# EAGLE schematic aux1.95 (EAGLE 6.5.0)
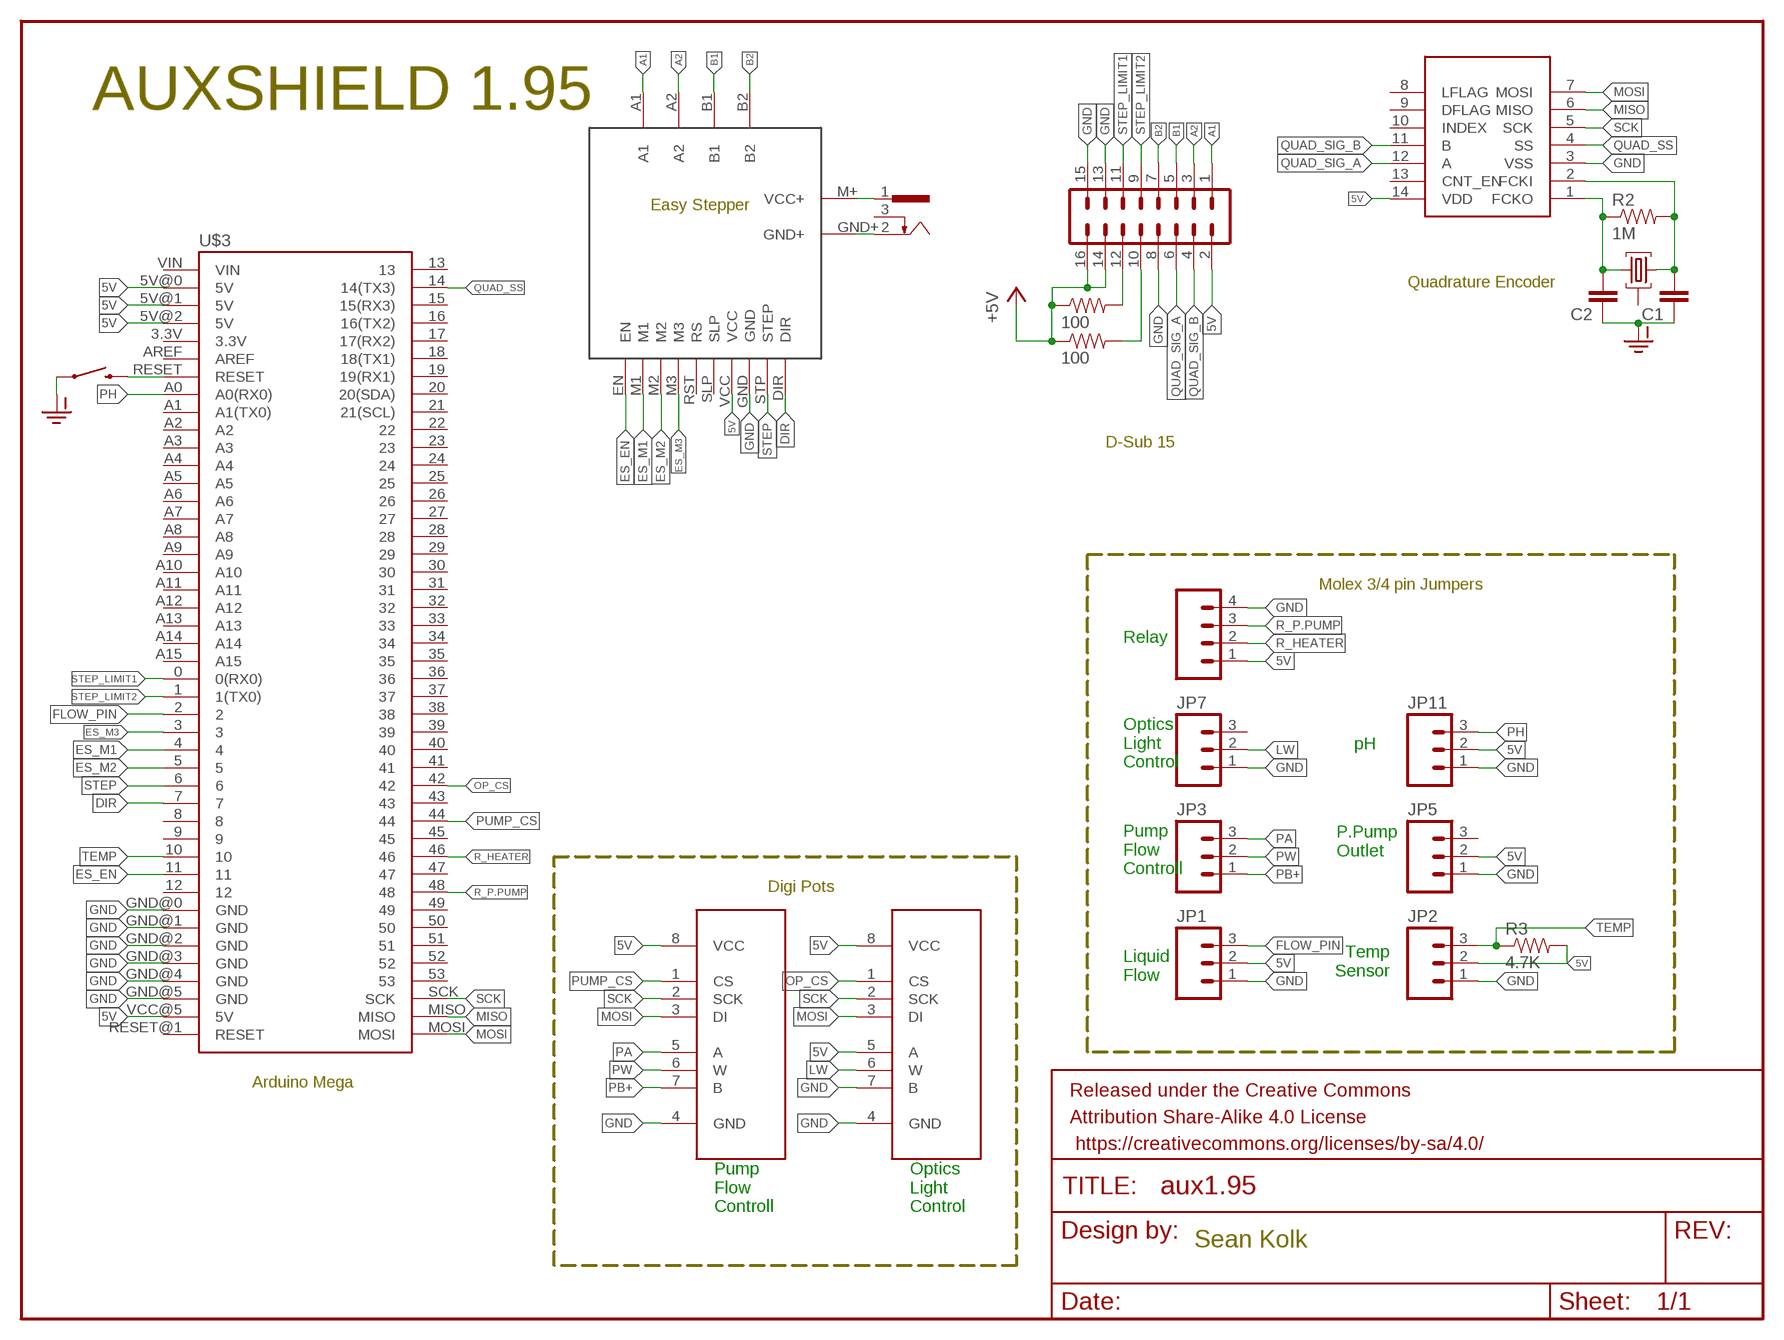
[diagram p0: schematic, sheet 1]

## Parts
C1  0.1UF-50V-20%(PTH)KIT-EZ  [CAP-PTH-SMALL-KIT]
C2  0.1UF-50V-20%(PTH)KIT-EZ  [CAP-PTH-SMALL-KIT]
FRAME1  FRAME-LETTER  [CREATIVE_COMMONS]
JP1  M03POLAR  [MOLEX-1X3]
JP2  M03POLAR  [MOLEX-1X3]
JP3  M03POLAR  [MOLEX-1X3]
JP5  M03POLAR  [MOLEX-1X3]
JP7  M03POLAR  [MOLEX-1X3]
JP11  M03POLAR  [MOLEX-1X3]
PUMPDIGIPOT  MCP41XXXDIL  [DIL-08]
QF2  14M20BHC49T  [HC49U]
R1  100  10OHM-1/4W-5%(PTH)  [AXIAL-0.3]
R2  1M  10OHM-1/4W-5%(PTH)  [AXIAL-0.3]
R3  4.7K  10OHM-1/4W-5%(PTH)  [AXIAL-0.3]
R4  100  10OHM-1/4W-5%(PTH)  [AXIAL-0.3]
RELAY  M04POLAR  [MOLEX-1X4]
S1  SWITCH-MOMENTARY-2PTH_EZ  [TACTILE-PTH-EZ]
U1  MCP41XXXDIL  [DIL-08]
U$1  M08X2  [2X8]
U$2  LS7366R  [SO014]
U$3  ARDUINO-MEGA-V2  [ARDUINO_MEGA-PRO-5V]
U$4  BIG_EASY_DRIVER  [BIG_EASY_DRIVER_PACK]
X1  SCD-014A  [SCD-014-A]

## Nets
5V: JP1.2 JP2.2 JP5.2 JP11.2 PUMPDIGIPOT.8(VCC) R1.P$1 R3.P$2 R4.P$1 RELAY.1 U1.5(A) U1.8(VCC) U$1.2 U$1.14 U$1.16 U$2.14(VDD) U$3.5V@0(5V) U$3.5V@1(5V) U$3.5V@2(5V) U$3.VCC@5(5V) U$4.VCC ; supply symbol labelled +5V
A1: U$1.1 U$4.A1
A2: U$1.3 U$4.A2
B1: U$1.5 U$4.B1
B2: U$1.7 U$4.B2
DIR: U$3.7 U$4.DIR
ES_EN: U$3.11 U$4.EN
ES_M1: U$3.4 U$4.M1
ES_M2: U$3.5 U$4.M2
ES_M3: U$3.3 U$4.M3
FLOW_PIN: JP1.3 U$3.2
GND: C1.1 C2.1 JP1.1 JP2.1 JP5.1 JP7.1 JP11.1 PUMPDIGIPOT.4(GND) RELAY.4 S1.1 U1.4(GND) U1.7(B) U$1.8 U$1.13 U$1.15 U$2.3(VSS) U$3.GND@0(GND) U$3.GND@1(GND) U$3.GND@2(GND) U$3.GND@3(GND) U$3.GND@4(GND) U$3.GND@5(GND) U$4.GND ; supply symbol labelled GND-ISO
LW: JP7.2 U1.6(W)
MISO: U$2.6(MISO) U$3.MISO
MOSI: PUMPDIGIPOT.3(DI) U1.3(DI) U$2.7(MOSI) U$3.MOSI
N$1: U$4.M+(VCC+) X1.1
N$2: U$4.GND+ X1.2
N$4: R1.P$2 U$1.10
N$9: S1.3 U$3.RESET
N$12: C1.2 QF2.3 R2.P$2 U$2.2(FCKI)
N$25: C2.2 QF2.1 R2.P$1 U$2.1(FCKO)
N$33: R4.P$2 U$1.12
OP_CS: U1.1(CS) U$3.42
PA: JP3.3 PUMPDIGIPOT.5(A)
PB+: JP3.1 PUMPDIGIPOT.7(B)
PH: JP11.3 U$3.A0(A0(RX0))
PUMP_CS: PUMPDIGIPOT.1(CS) U$3.44
PW: JP3.2 PUMPDIGIPOT.6(W)
QUAD_SIG_A: U$1.6 U$2.12(A)
QUAD_SIG_B: U$1.4 U$2.11(B)
QUAD_SS: U$2.4(SS) U$3.14(14(TX3))
R_HEATER: RELAY.2 U$3.46
R_P.PUMP: RELAY.3 U$3.48
SCK: PUMPDIGIPOT.2(SCK) U1.2(SCK) U$2.5(SCK) U$3.SCK
STEP: U$3.6 U$4.STP(STEP)
STEP_LIMIT1: U$1.11 U$3.0(0(RX0))
STEP_LIMIT2: U$1.9 U$3.1(1(TX0))
TEMP: JP2.3 R3.P$1 U$3.10
Unconnected: JP5.3 JP7.3 QF2.2 U$2.8(LFLAG) U$2.9(DFLAG) U$2.10(INDEX) U$2.13(CNT_EN) U$3.3.3V U$3.8 U$3.9 U$3.12 U$3.13 U$3.15(15(RX3)) U$3.16(16(TX2)) U$3.17(17(RX2)) U$3.18(18(TX1)) U$3.19(19(RX1)) U$3.20(20(SDA)) U$3.21(21(SCL)) U$3.22 U$3.23 U$3.24 U$3.25 U$3.26 U$3.27 U$3.28 U$3.29 U$3.30 U$3.31 U$3.32 U$3.33 U$3.34 U$3.35 U$3.36 U$3.37 U$3.38 U$3.39 U$3.40 U$3.41 U$3.43 U$3.45 U$3.47 U$3.49 U$3.50 U$3.51 U$3.52 U$3.53 U$3.A1(A1(TX0)) U$3.A2 U$3.A3 U$3.A4 U$3.A5 U$3.A6 U$3.A7 U$3.A8 U$3.A9 U$3.A10 U$3.A11 U$3.A12 U$3.A13 U$3.A14 U$3.A15 U$3.AREF U$3.RESET@1(RESET) U$3.VIN U$4.RST(RS) U$4.SLP X1.3

## Notes on the sheet
- AUXSHIELD 1.95
- Easy Stepper
- Quadrature Encoder
- D-Sub 15
- Molex 3/4 pin Jumpers
- Relay
- pH
- Optics
  Light 
  Control
- P.Pump 
  Outlet
- Pump
  Flow
  Controll
- Digi Pots
- Temp
  Sensor
- Liquid 
  Flow
- Arduino Mega
- Pump
  Flow
  Controll
- Optics
  Light
  Control
- Sean Kolk

## Library data of the parts
C1 C2 = SparkFun-Capacitors:0.1UF-50V-20%(PTH): CAP-08370; PROD_ID: CAP-08370
FRAME1 = SparkFun-Aesthetics:FRAME-LETTER: Schematic Frame Standard 8.5x11 US Letter frame
JP1-JP3 JP5 JP7 JP11 = SparkFun-Connectors:M03: Header 3 Standard 3-pin 0.1" header. Use with straight break away headers (SKU : PRT-00116), right angle break away headers (PRT-00553), swiss pins (PRT-00743), machine pins (PRT-00117), and female headers (PRT-00115). Molex polarized connector foot print use with SKU : PRT-08232 with associated crimp pins and housings.
PUMPDIGIPOT U1 = SparkFun-AnalogIC:MCP41XXX: SPI controlled single digital potentiometer by Microchip PID: COM-10613
QF2 = crystal:14M20BHC49T: Monolithic Crystal Filters Source: www.vanlong.com; OC_FARNELL: unknown; OC_NEWARK: unknown
R1-R4 = SparkFun-Resistors:10OHM-1/4W-5%(PTH): RES-10698; PROD_ID: RES-10698; VALUE: 10
RELAY = SparkFun-Connectors:M04: Header 4 Standard 4-pin 0.1" header. Use with straight break away headers (SKU : PRT-00116), right angle break away headers (PRT-00553), swiss pins (PRT-00743), machine pins (PRT-00117), and female headers (PRT-00115). Molex polarized connector foot print use with SKU : PRT-08231 with associated crimp pins and housings. 1MM SMD Version SKU: PRT-10208
S1 = SparkFun-Electromechanical:SWITCH-MOMENTARY-2: Various NO switches- pushbuttons, reed, etc
U$1 = SparkFun-Connectors:M08X2: .1" headers, two rows of 8 each
U$2 = SparkFun-DigitalIC:LS7366R
U$3 = MEGASHIELD2:ARDUINO-MEGA-V2
U$4 = SparkFun-Boards:BIG_EASY_DRIVER
X1 = con-shiua-chyuan:SCD-014A: Power Jack 2.5mm; OC_FARNELL: unknown; OC_NEWARK: unknown